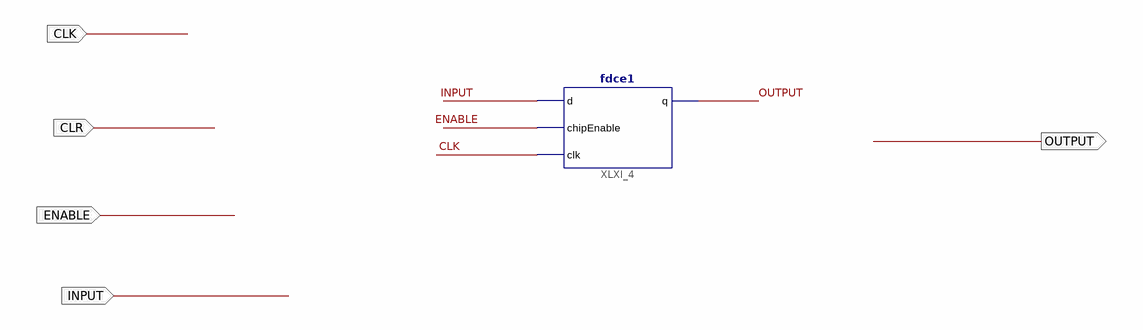
[diagram p0: schematic sheet 1]
// Xilinx ISE schematic LATCH1.sch (artix7) as structural Verilog: 1 symbols, 5 ports
module LATCH1 (
  input  CLK,
  input  CLR,
  input  ENABLE,
  input  INPUT,
  output OUTPUT
);

  fdce1 XLXI_4 (.clk(CLK), .chipEnable(ENABLE), .d(INPUT), .q(OUTPUT));
endmodule
